# EAGLE design Hanna.Gościniak (EAGLE 9.6.2)
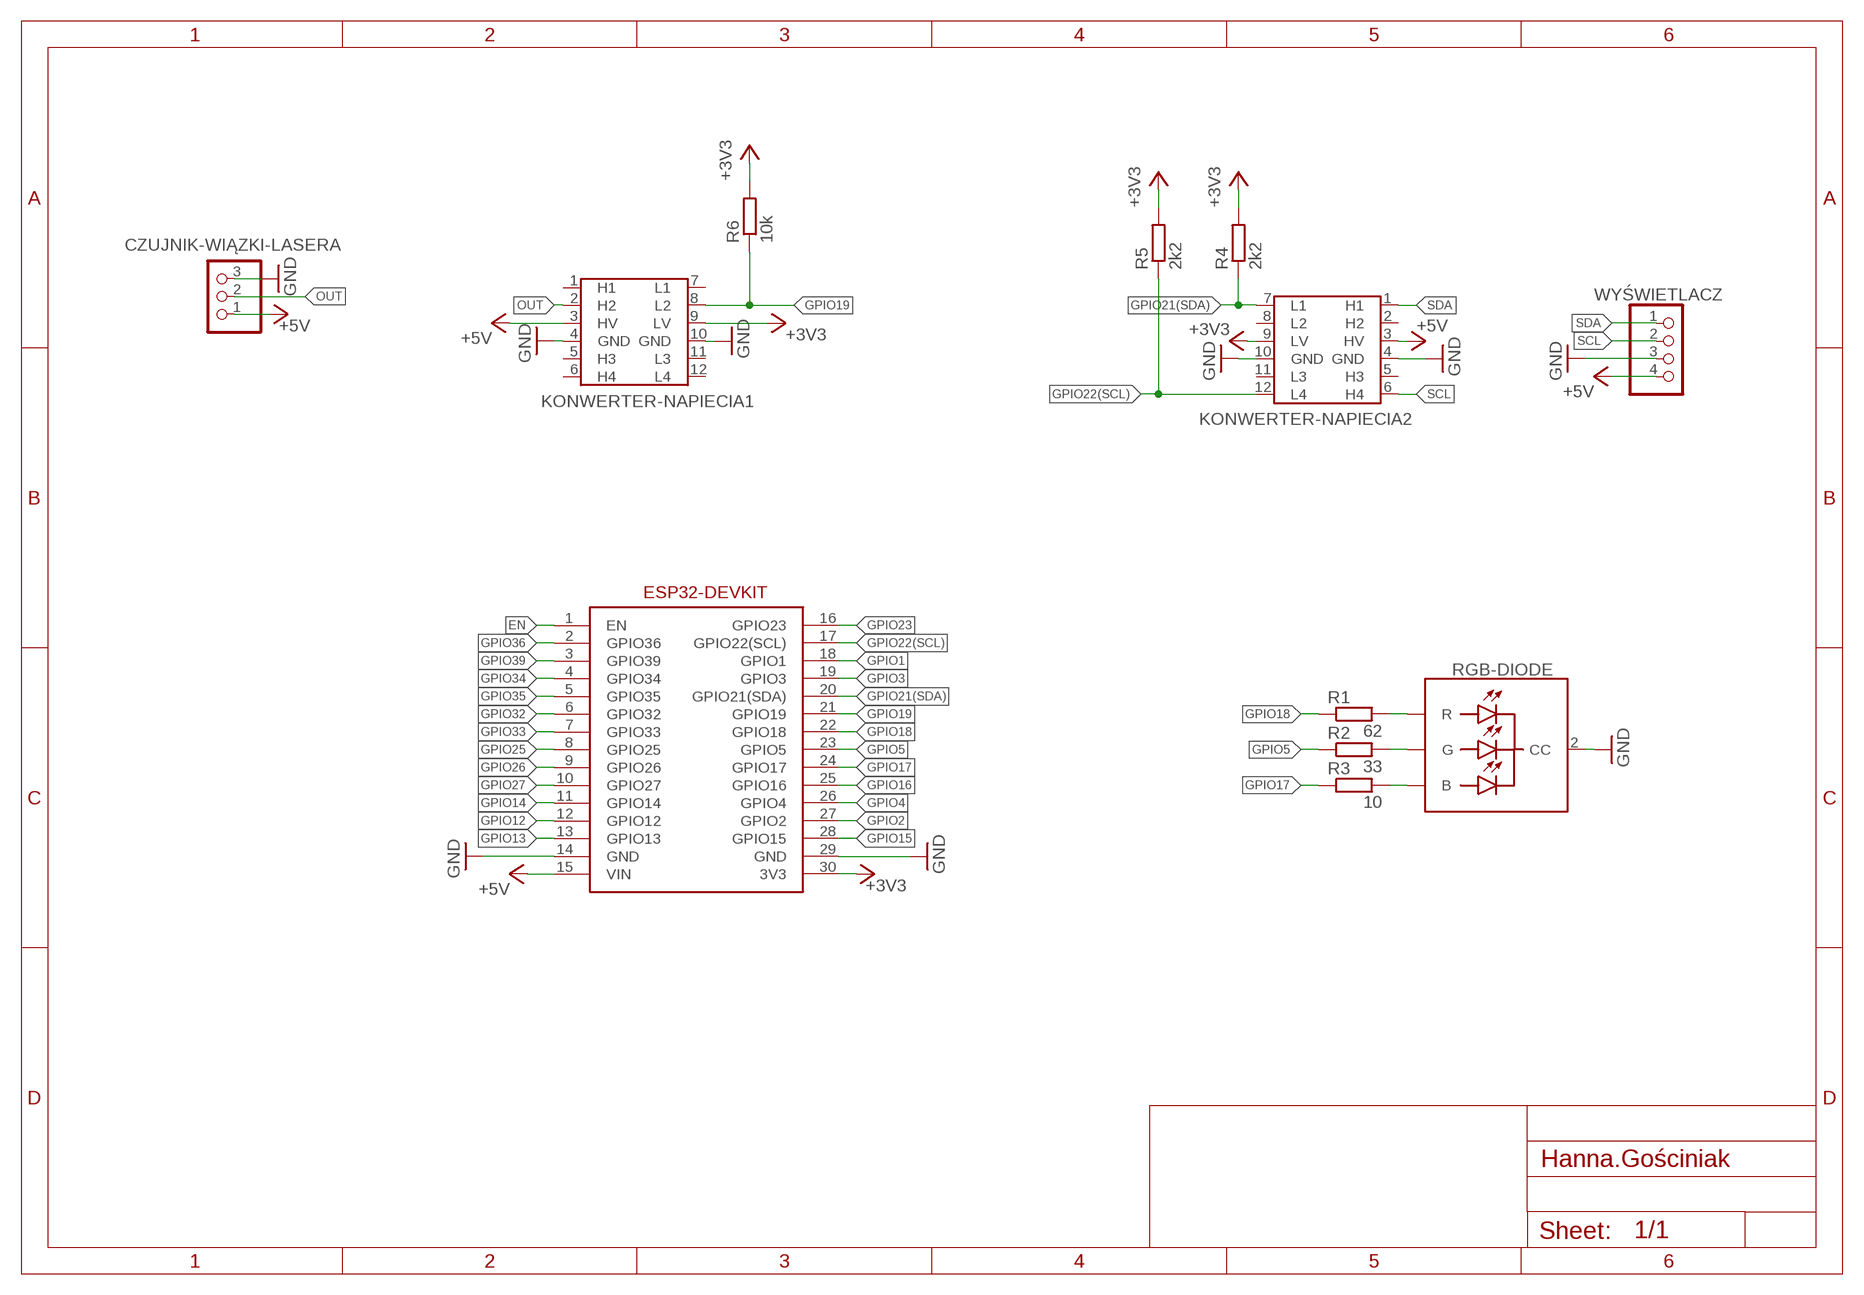
[diagram p0: schematic, sheet 1]

## Parts
CZUJNIK-WIĄZKI-LASERA  1  PINHD-1X3  [1X03]
KONWERTER-NAPIECIA1  KONWERTER-NAPIECIA-3.3/5V  [KONWERTER-NAPIECIA-3.3/5V]
KONWERTER-NAPIECIA2  KONWERTER-NAPIECIA-3.3/5V  [KONWERTER-NAPIECIA-3.3/5V]
R1  62  R-EU_0207/10  [0207/10]
R2  33  R-EU_0207/10  [0207/10]
R3  10  R-EU_0207/10  [0207/10]
R4  2k2  R-EU_0207/10  [0207/10]
R5  2k2  R-EU_0207/10  [0207/10]
R6  10k  R-EU_0207/10  [0207/10]
RGB1  RGB-DIODE  [RGB]
U$1  ESP32-DEVKIT  [ESP32-DEVKIT]
WYŚWIETLACZ  1  PINHD-1X4  [1X04]

## Nets
+3V3: KONWERTER-NAPIECIA1.9(LV) KONWERTER-NAPIECIA2.9(LV) R4.2 R5.2 R6.2 U$1.30(3V3)
+5V: CZUJNIK-WIĄZKI-LASERA.1 KONWERTER-NAPIECIA1.3(HV) KONWERTER-NAPIECIA2.3(HV) U$1.15(VIN) WYŚWIETLACZ.4
EN: U$1.1(EN)
GND: CZUJNIK-WIĄZKI-LASERA.3 KONWERTER-NAPIECIA1.4(GND) KONWERTER-NAPIECIA1.10(GND) KONWERTER-NAPIECIA2.4(GND) KONWERTER-NAPIECIA2.10(GND) RGB1.2(CC) U$1.14(GND) U$1.29(GND) WYŚWIETLACZ.3
GPIO1: U$1.18(GPIO1)
GPIO2: U$1.27(GPIO2)
GPIO3: U$1.19(GPIO3)
GPIO4: U$1.26(GPIO4)
GPIO5: R2.1 U$1.23(GPIO5)
GPIO12: U$1.12(GPIO12)
GPIO13: U$1.13(GPIO13)
GPIO14: U$1.11(GPIO14)
GPIO15: U$1.28(GPIO15)
GPIO16: U$1.25(GPIO16)
GPIO17: R3.1 U$1.24(GPIO17)
GPIO18: R1.1 U$1.22(GPIO18)
GPIO19: KONWERTER-NAPIECIA1.8(L2) R6.1 U$1.21(GPIO19)
GPIO21(SDA): KONWERTER-NAPIECIA2.7(L1) R4.1 U$1.20(GPIO21(SDA))
GPIO22(SCL): KONWERTER-NAPIECIA2.12(L4) R5.1 U$1.17(GPIO22(SCL))
GPIO23: U$1.16(GPIO23)
GPIO25: U$1.8(GPIO25)
GPIO26: U$1.9(GPIO26)
GPIO27: U$1.10(GPIO27)
GPIO32: U$1.6(GPIO32)
GPIO33: U$1.7(GPIO33)
GPIO34: U$1.4(GPIO34)
GPIO35: U$1.5(GPIO35)
GPIO36: U$1.2(GPIO36)
GPIO39: U$1.3(GPIO39)
N$2: R1.2 RGB1.1(R)
N$3: R2.2 RGB1.3(G)
N$4: R3.2 RGB1.4(B)
OUT: CZUJNIK-WIĄZKI-LASERA.2 KONWERTER-NAPIECIA1.2(H2)
SCL: KONWERTER-NAPIECIA2.6(H4) WYŚWIETLACZ.2
SDA: KONWERTER-NAPIECIA2.1(H1) WYŚWIETLACZ.1
Unconnected: KONWERTER-NAPIECIA1.1(H1) KONWERTER-NAPIECIA1.5(H3) KONWERTER-NAPIECIA1.6(H4) KONWERTER-NAPIECIA1.7(L1) KONWERTER-NAPIECIA1.11(L3) KONWERTER-NAPIECIA1.12(L4) KONWERTER-NAPIECIA2.2(H2) KONWERTER-NAPIECIA2.5(H3) KONWERTER-NAPIECIA2.8(L2) KONWERTER-NAPIECIA2.11(L3)

## Library data of the parts
CZUJNIK-WIĄZKI-LASERA = Hanna.Gościniak:PINHD-1X3: PIN HEADER
KONWERTER-NAPIECIA1 KONWERTER-NAPIECIA2 = Hanna.Gościniak:KONWERTER-NAPIECIA-3.3/5V
R1-R6 = Hanna.Gościniak:R-EU_: RESISTOR, European symbol; SPICEPREFIX: R
RGB1 = Hanna.Gościniak:RGB-DIODE
U$1 = Hanna.Gościniak:ESP32-DEVKIT
WYŚWIETLACZ = Hanna.Gościniak:PINHD-1X4: PIN HEADER

## Module WYŚWIETLACZ
Ports: 

### Library data of the parts

## Module ESP32-DEVKIT
Ports: 

### Library data of the parts

## Board
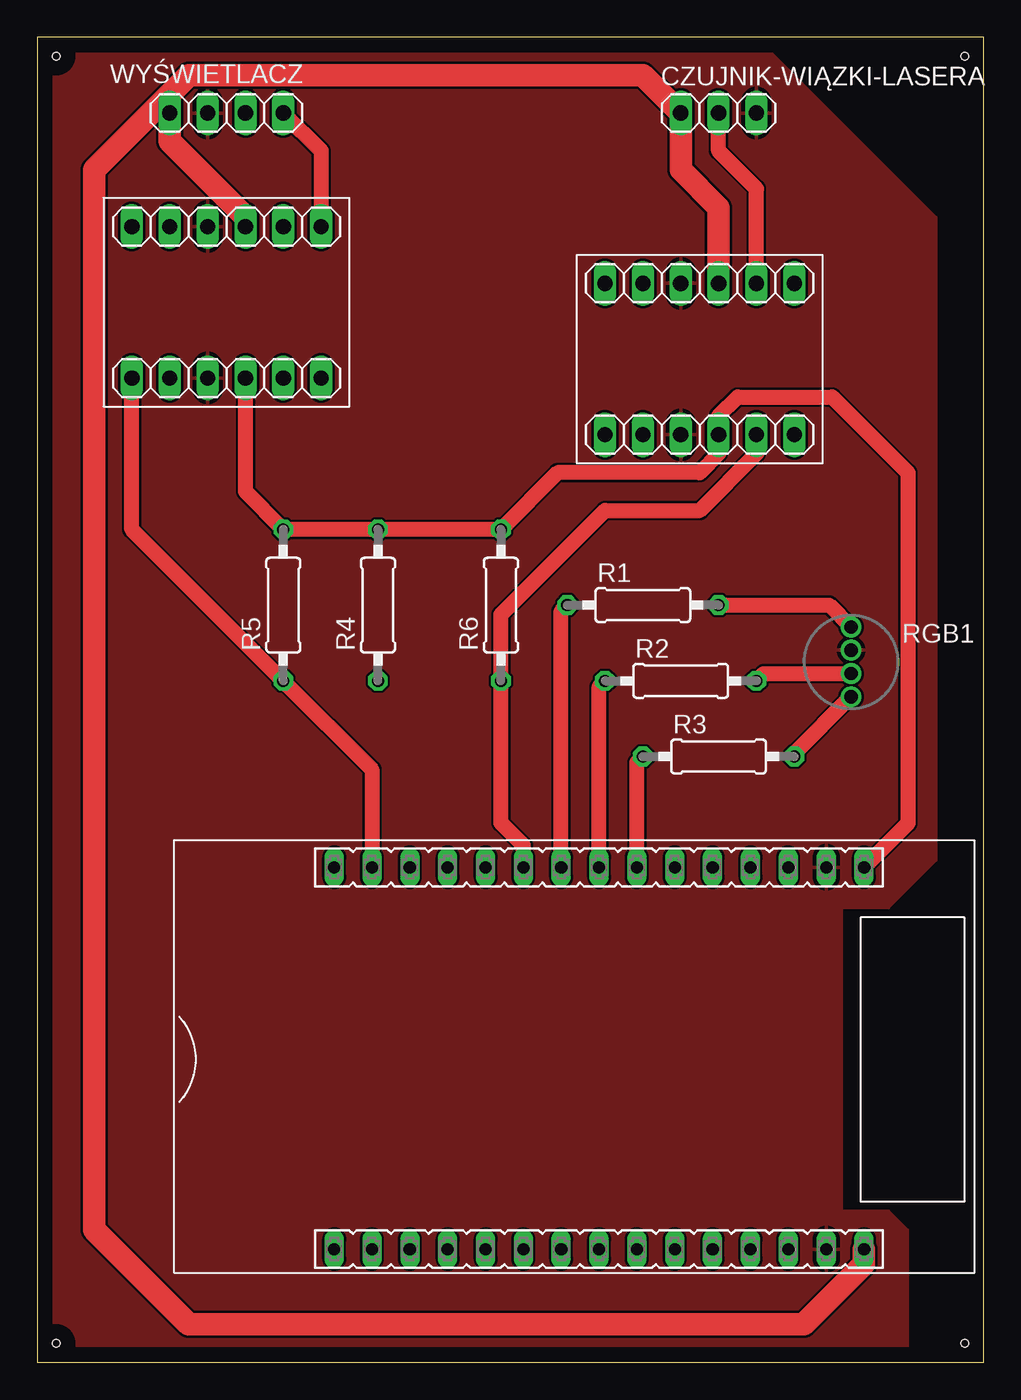
[diagram p1: board, top side]
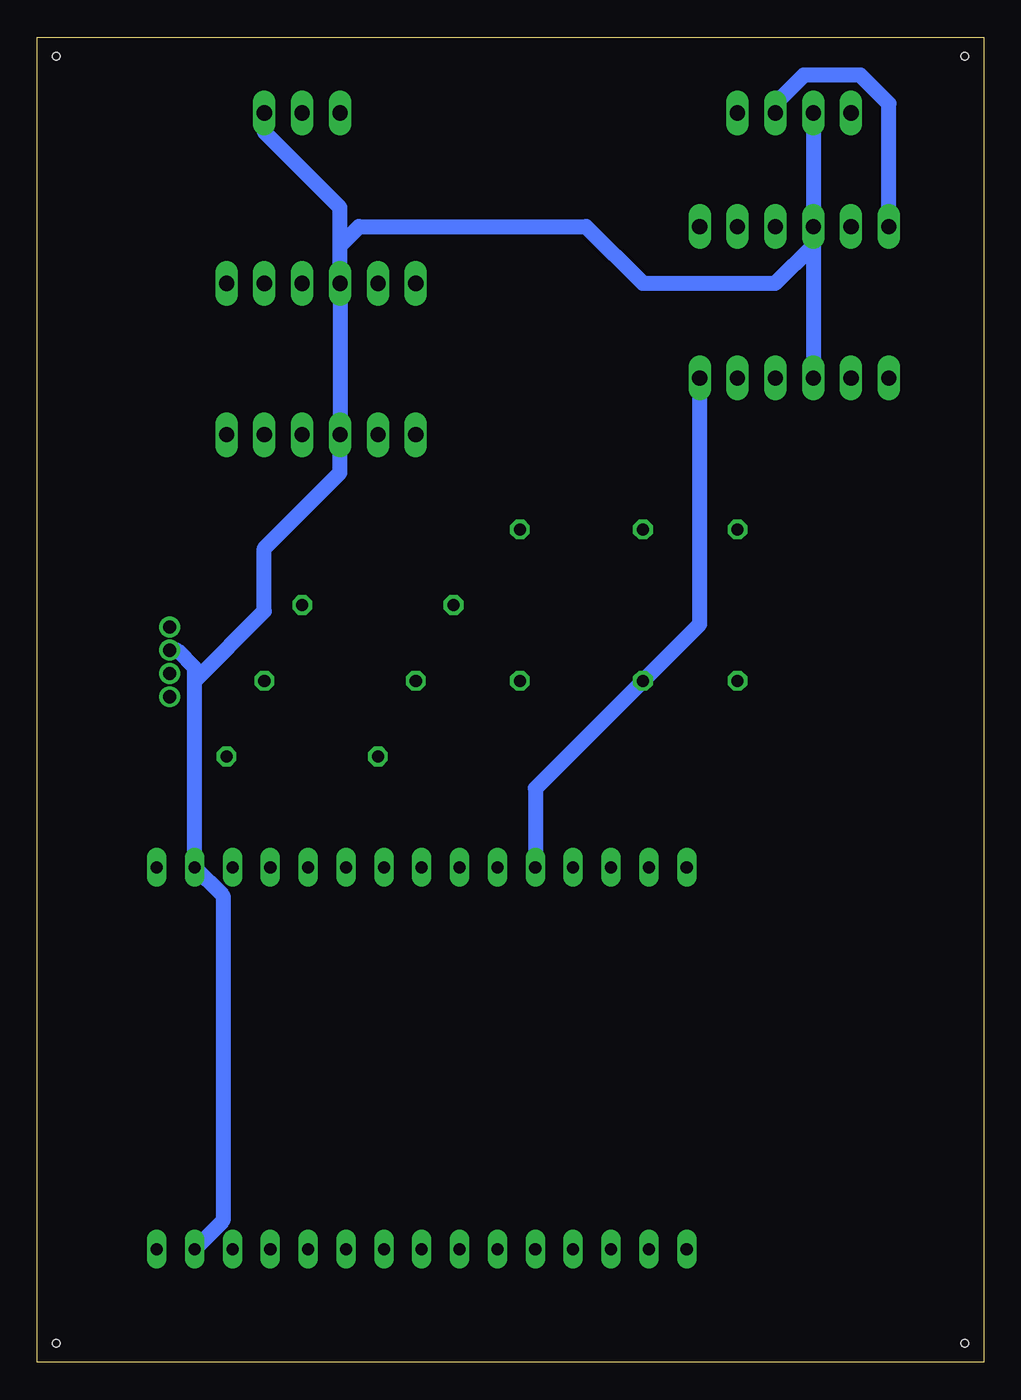
[diagram p2: board, bottom side, seen from below]

Size 63.5 x 88.9 mm. Coordinates in mm from the lower left corner, seen from the top.
Outline: 0,0 63.5,0 63.5,88.9 0,88.9 0,0
Copper layers (1*16): Top 0.035mm / dielectric 1.5mm / Bottom 0.035mm
Design rules "default": minimum track width 6mil, minimum drill 0.35mm, track to track 6mil, track to pad 6mil, pad to pad 6mil, via to via 6mil, smd to smd 6mil, copper to edge 40mil, drill to drill 6mil, minimum pad ring 10mil, minimum via ring 8mil, stop-mask expansion 4mil, vias tented up to drill 0mil, thermal gap 10mil
Holes 0.51 mm at 1.27,1.27 62.23,1.27 62.23,87.63 1.27,87.63

### Footprints (pad centres in the part's own frame; a part is rotated, then mirrored left to right if it is on the bottom)
1X03 = drill 1.016 long: 1 -2.54,0; 2 0,0; 3 2.54,0
KONWERTER-NAPIECIA-3.3/5V = drill 1.016 long: 1 -6.35,-5.08; 2 -3.81,-5.08; 3 -1.27,-5.08; 4 1.27,-5.08; 5 3.81,-5.08; 6 6.35,-5.08; 7 -6.35,5.08; 8 -3.81,5.08; 9 -1.27,5.08; 10 1.27,5.08; 11 3.81,5.08; 12 6.35,5.08
0207/10 = drill 0.813 octagon: 1 -5.08,0; 2 5.08,0
RGB = drill 0.889 pad 1.092: 1 0,2.337; 2 0,0.787; 3 0,-0.787; 4 0,-2.337
ESP32-DEVKIT = drill 0.813 long: 1 -15.64,-12.73; 2 -13.1,-12.73; 3 -10.56,-12.73; 4 -8.02,-12.73; 5 -5.48,-12.73; 6 -2.94,-12.73; 7 -0.4,-12.73; 8 2.14,-12.73; 9 4.68,-12.73; 10 7.22,-12.73; 11 9.76,-12.73; 12 12.3,-12.73; 13 14.84,-12.73; 14 17.38,-12.73; 15 19.92,-12.73; 16 -15.64,12.89; 17 -13.1,12.89; 18 -10.56,12.89; 19 -8.02,12.89; 20 -5.48,12.89; 21 -2.94,12.89; 22 -0.4,12.89; 23 2.14,12.89; 24 4.68,12.89; 25 7.22,12.89; 26 9.76,12.89; 27 12.3,12.89; 28 14.84,12.89; 29 17.38,12.89; 30 19.92,12.89
1X04 = drill 1.016 long: 1 -3.81,0; 2 -1.27,0; 3 1.27,0; 4 3.81,0

### Placement (x,y rotation side)
CZUJNIK-WIĄZKI-LASERA  45.72,83.82 0 top
KONWERTER-NAPIECIA1  44.45,67.31 180 top
KONWERTER-NAPIECIA2  12.7,71.12 180 top
R1  40.64,50.8 0 top
R2  43.18,45.72 0 top
R3  45.72,40.64 0 top
R4  22.86,50.8 90 top
R5  16.51,50.8 90 top
R6  31.11,50.8 90 top
RGB1  54.61,46.99 0 top
U$1  35.56,20.32 0 top
WYŚWIETLACZ  12.7,83.82 180 top

### Tracks (layer width: path | path; a pad name or v marks a point on that pad's centre or on a via)
+3V3
  Top 1.016: U$1.30 58.42,36.15 58.42,59.69 53.34,64.77 46.99,64.77 45.72,63.5 KONWERTER-NAPIECIA1.9 45.72,60.96 44.45,59.69 34.92,59.69 R6.2 R4.2 R5.2 13.97,58.42 KONWERTER-NAPIECIA2.9
+5V
  Top 1.524: 8.89,85.09 WYŚWIETLACZ.4 8.89,81.92 13.97,76.83 KONWERTER-NAPIECIA2.3 | 8.89,85.09 10.16,86.36 40.64,86.36 CZUJNIK-WIĄZKI-LASERA.1 43.18,80.01 45.72,77.47 KONWERTER-NAPIECIA1.3 | U$1.15 55.48,6.58 51.44,2.54 10.16,2.54 3.81,8.89 3.81,80.01 8.89,85.09
GND
  Bottom 1.016: U$1.14 51.03,9.49 51.03,31.3 U$1.29 52.94,45.72 | RGB1.2 54.13,47.78 52.94,46.59 52.94,45.72 | 43.18,74.93 KONWERTER-NAPIECIA1.4 KONWERTER-NAPIECIA1.10 43.18,59.69 48.26,54.61 48.26,50.4 52.94,45.72 | 43.18,74.93 43.18,77.47 48.26,82.55 CZUJNIK-WIĄZKI-LASERA.3 | 43.18,74.93 41.91,76.2 26.67,76.2 22.86,72.39 13.97,72.39 11.43,74.93 KONWERTER-NAPIECIA2.4 | WYŚWIETLACZ.3 KONWERTER-NAPIECIA2.4 | KONWERTER-NAPIECIA2.4 KONWERTER-NAPIECIA2.10
  pour Top: 0,88.9 0,0 58.42,0 58.42,8.89 57.15,10.16 53.98,10.16 53.98,30.48 57.15,30.48 60.33,33.66 60.33,76.83 48.26,88.9
GPIO5
  Top 1.016: U$1.23 37.7,45.32 R2.1
GPIO17
  Top 1.016: U$1.24 40.24,40.24 R3.1
GPIO18
  Top 1.016: U$1.22 35.16,50.4 R1.1
GPIO19
  Top 1.016: U$1.21 32.62,34.69 31.11,36.2 R6.1 31.11,50.16 38.1,57.15 44.45,57.15 48.26,60.96 KONWERTER-NAPIECIA1.8
GPIO21(SDA)
  Bottom 1.016: KONWERTER-NAPIECIA2.7 19.05,49.53 R4.1 30.08,38.5 U$1.20
GPIO22(SCL)
  Top 1.016: U$1.17 22.46,39.77 R5.1 6.35,55.88 KONWERTER-NAPIECIA2.12
N$2
  Top 1.016: R1.2 53.14,50.8 RGB1.1
N$3
  Top 1.016: R2.2 48.74,46.2 RGB1.3
N$4
  Top 1.016: R3.2 50.8,40.84 RGB1.4
OUT
  Top 1.016: KONWERTER-NAPIECIA1.2 48.26,78.74 45.72,81.28 CZUJNIK-WIĄZKI-LASERA.2
SCL
  Bottom 1.016: WYŚWIETLACZ.2 13.97,84.45 12.06,86.36 8.26,86.36 6.35,84.45 KONWERTER-NAPIECIA2.6
SDA
  Top 1.016: WYŚWIETLACZ.1 19.05,81.28 KONWERTER-NAPIECIA2.1